# Altium schematic sheet microphone.SchDoc
size A3
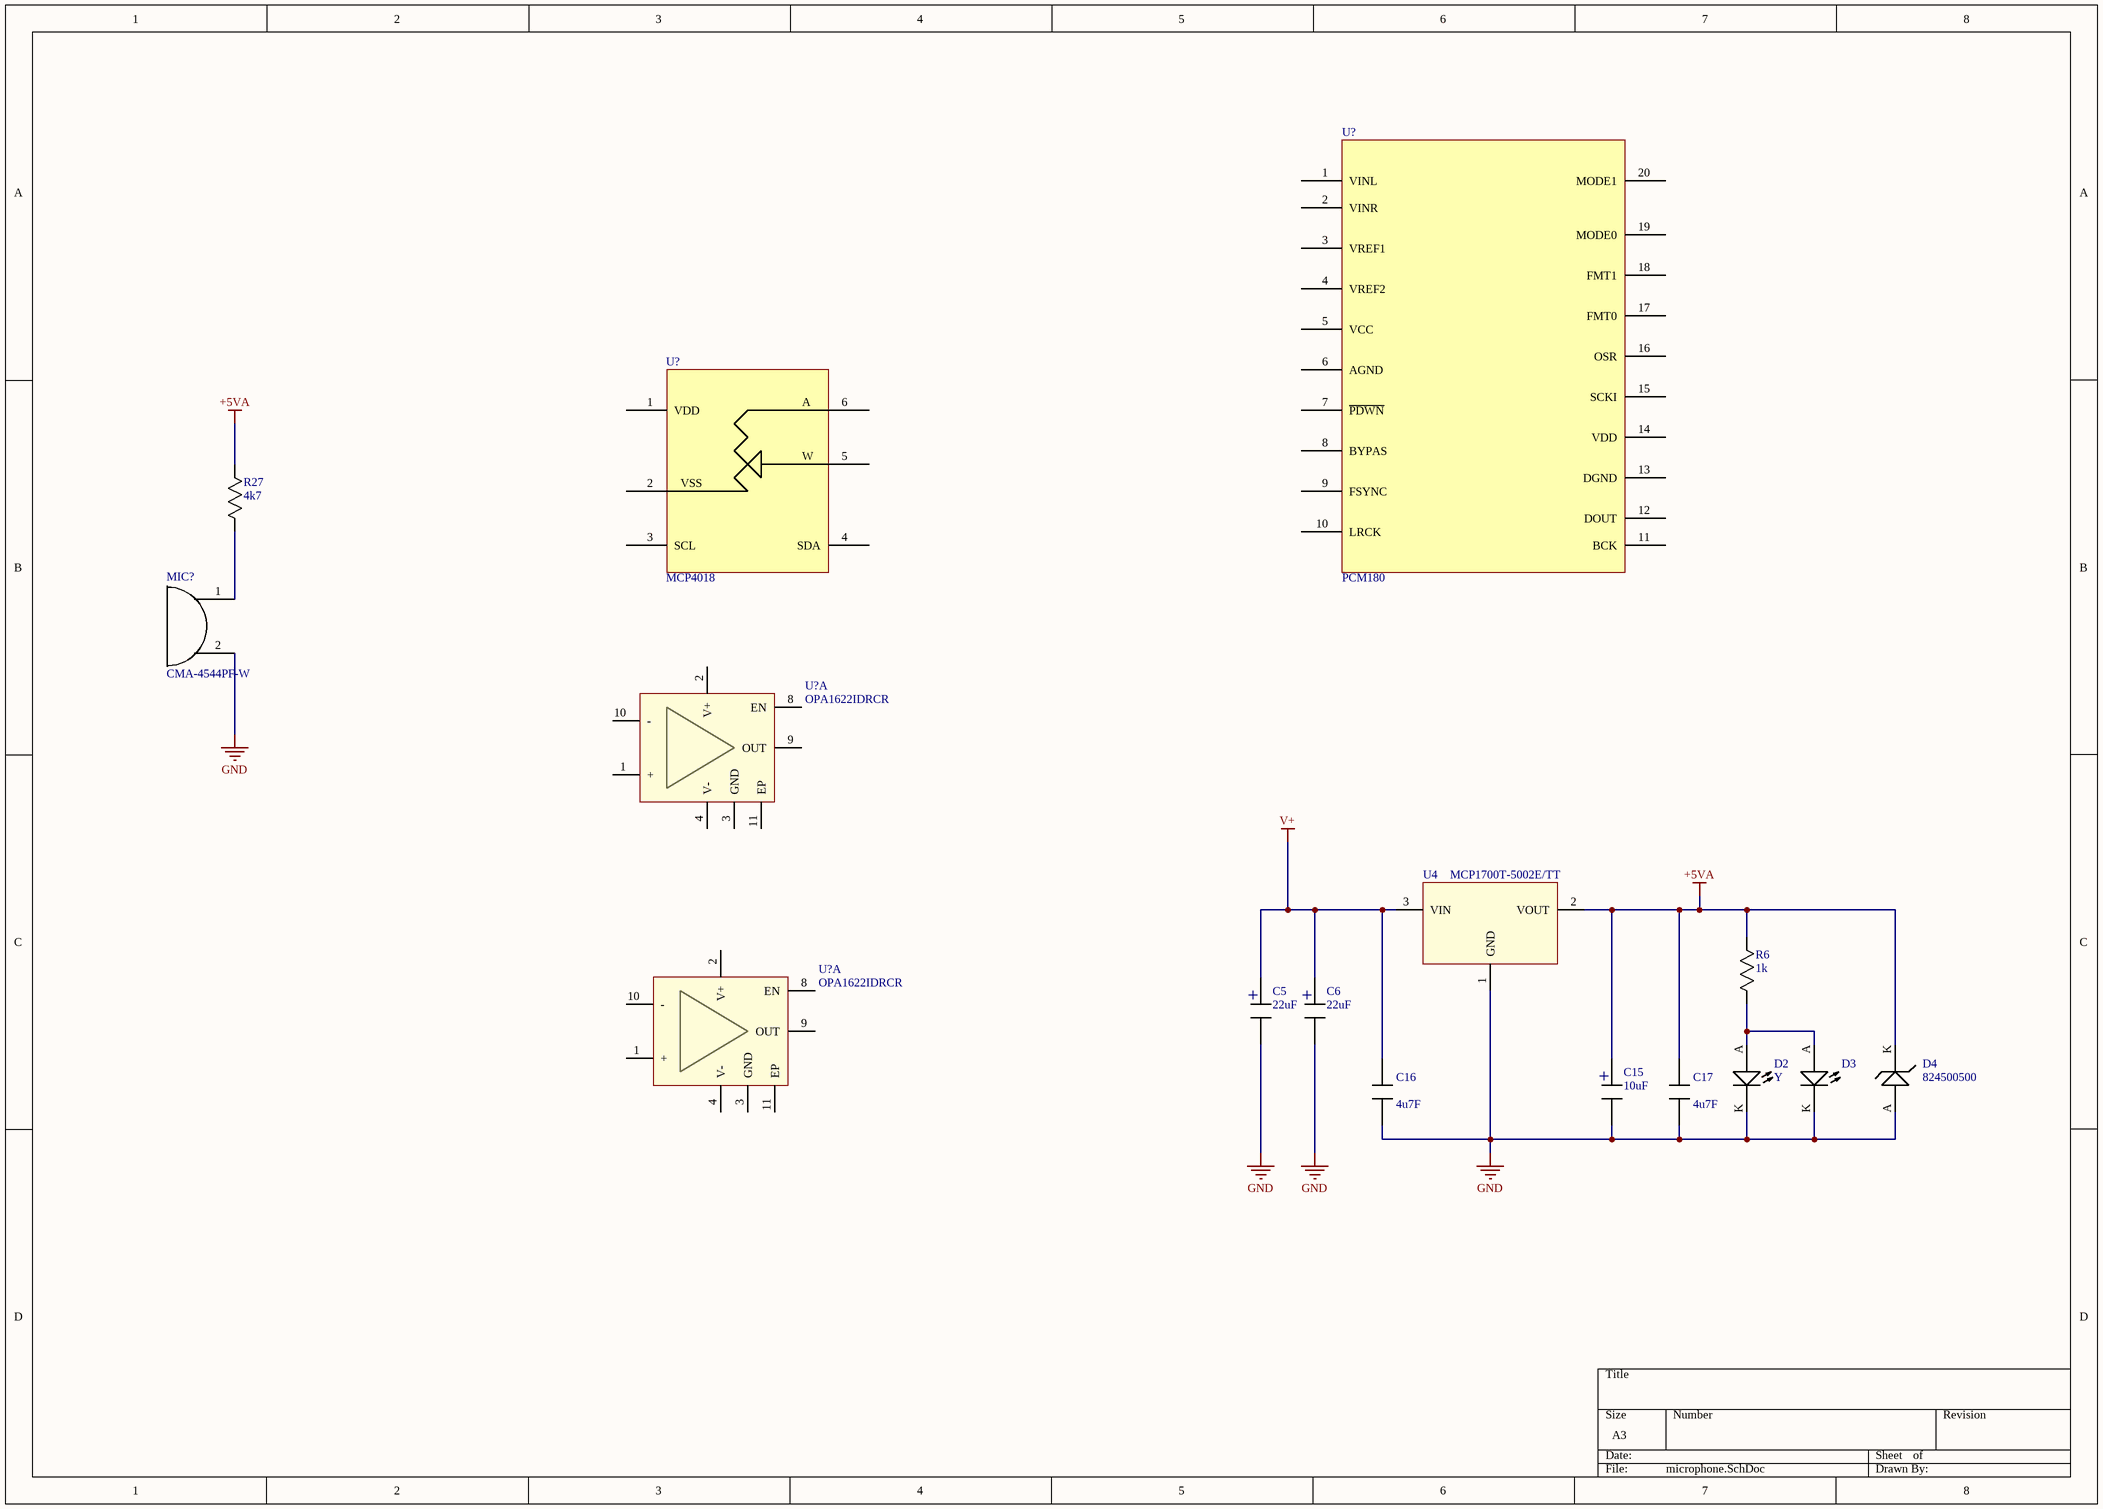
[diagram p0: microphone.SchDoc]

## Parts
(Parts that share a designator on the sheet are numbered #1, #2 ... from top to bottom, then left to right.)
C5  value 22uF  [CAP_RAD_SMD_DIA157]  (hidden comment: Capacitor_Polarized)
C6  value 22uF  [CAP_RAD_SMD_DIA157]  (hidden comment: Capacitor_Polarized)
C15  value 10uF  [CAP_RAD_SMD_DIA157]  (hidden comment: Capacitor_Polarized)
C16  value 4u7F  [0805]  (hidden comment: Capacitor)
C17  value 4u7F  [0603]  (hidden comment: Capacitor)
D2  Type: Y  [0805_LED]  (hidden comment: Diode_LED)
D3  Diode_LED  [0805_LED]  (value not drawn)
D4  Mfg_PN: 824500500  [DIODE_DO-214AC/SMA]  (hidden comment: Diode_zener)
MIC?  CMA-4544PF-W  [MIC]
R6  value 1k  [0603]  (hidden comment: Resistor)
R27  value 4k7  [0603]  (hidden comment: Resistor)
U4  Mfg_PN: MCP1700T-5002E/TT  [SOT23_132]  (hidden comment: MCP1700)
U?#1  PCM180  [20-SSOP]
U?#2  MCP4018  [6-TSSOP]
U?#3  Mfg_PN: OPA1622IDRCR  [10-VFDFN]  (hidden comment: OPA1622)  (part A of 2)
U?#4  Mfg_PN: OPA1622IDRCR  [10-VFDFN]  (hidden comment: OPA1622)  (part A of 2)

## Nets
+5VA: C15.+ C17.1 D4.K R6.2 R27.1 U4.2(VOUT)
GND: C5.- C6.- C15.- C16.2 C17.2 D2.K D3.K D4.A U4.1(GND)
V+: C5.+ C6.+ C16.1 U4.3(VIN)
NetD2_A: D2.A D3.A R6.1

Not connected (* = marked no-connect by the designer): MIC? 1 2; R27 2; U?#1 1(VINL) 2(VINR) 3(VREF1) 4(VREF2) 5(VCC) 6(AGND) 7(~{PDWN}) 8(BYPAS) 9(FSYNC) 10(LRCK) 11(BCK) 12(DOUT) 13(DGND) 14(VDD) 15(SCKI) 16(OSR) 17(FMT0) 18(FMT1) 19(MODE0) 20(MODE1); U?#2 1(VDD) 2(VSS) 3(SCL) 4(SDA) 5(W) 6(A); U?#3 1(+) 2(V+) 3(GND) 4(V-) 8(EN) 9(OUT) 10(-) 11(EP); U?#4 1(+) 2(V+) 3(GND) 4(V-) 8(EN) 9(OUT) 10(-) 11(EP)

## Library data of the parts
C5 = Capacitor_Polarized: Capacitor; Mfg: Panasonic; Mfg_PN: Part Number EEE-FT1V220AR; HelpURL: *; NI: *; Supplier1: Digikey; Supplier1_PN: PCE5012CT-ND; Tolerance: *; Type: *; Rating: *
C6 = Capacitor_Polarized: Capacitor; Mfg: Panasonic; Mfg_PN: EEE-FT1V220AR; HelpURL: *; NI: *; Supplier1: Digikey; Supplier1_PN: PCE5012CT-ND; Tolerance: *; Type: *; Rating: *
C15 = Capacitor_Polarized: Capacitor; Mfg: Nichicon; Mfg_PN: UWX1C100MCL1GB; HelpURL: *; NI: *; Supplier1: Digikey; Supplier1_PN: 493-2100-1-ND; Tolerance: *; Type: *; Rating: *
C16 C17 = Capacitor: Mfg: Samsung; Mfg_PN: CL21A475KAQNNNG; HelpURL: *; NI: *; Supplier1: Digikey; Supplier1_PN: 1276-6462-1-ND; Tolerance: *; Type: *; Rating: *
D2 = Diode_LED: LED; Mfg: Osram; Mfg_PN: LY R976-PS-36; HelpURL: *; NI: *; Supplier1: Digikey; Supplier1_PN: 475-2560-1-ND; Tolerance: *; Rating: *; Value: *
D3 = Diode_LED: LED; Mfg: Osram; Mfg_PN: LY R976-PS-36; Type: Y; HelpURL: *; Supplier1: Digikey; Supplier1_PN: 475-2560-1-ND; Tolerance: *; Rating: *; Value: *
D4 = Diode_zener: Diode; Mfg: Wurth; HelpURL: *; NI: *; Supplier1: Digikey; Supplier1_PN: 732-9974-1-ND; Tolerance: *; Type: *; Rating: *; Value: *
MIC? = CMA-4544PF-W: Mfg: CUI Inc.; CreatedBy: Emile Laplante; HelpURL: https://www.digikey.ca/product-detail/en/cui-inc/CMA-4544PF-W/102-1721-ND/1869981; Mfg Part Number: CMA-4544PF-W; NI: *; Package: *; Power: *; Supplier: Digi-Key; Supplier Part Numer: 102-1721-ND; Temperature: *; Value: *; VerifiedBy: *; Voltage: *
R6 = Resistor: Mfg: Yageo; Mfg_PN: RC0603JR-071KL; HelpURL: *; NI: *; Supplier1: Digikey; Supplier1_PN: 311-1.0KGRCT-ND; Type: *; Rating: *; Tolerance: *
R27 = Resistor: Mfg: Yageo; Mfg_PN: RC0603JR-074K7L; HelpURL: *; NI: *; Supplier1: Digikey; Supplier1_PN: 311-4.7KGRCT-ND; Type: *; Rating: *; Tolerance: *
U4 = MCP1700: Linear voltage regulator; Mfg: Microchip; HelpURL: http://ww1.microchip.com/downloads/en/DeviceDoc/20001826C.pdf; NI: *; Supplier1: Digikey; Supplier1_PN: MCP1700T5002ETTCT-ND; Type: *
U?#1 = PCM180: Mfg Part Number: PCM1802DBR; Mfg: Texas Instruments; CreatedBy: Emile Laplante; HelpURL: https://www.digikey.ca/product-detail/en/texas-instruments/PCM1802DBR/296-26304-1-ND/2254955; NI: *; Power: *; Supplier: digikey; Supplier Part Numer: 296-26304-1-ND; Temperature: *; Value: *; VerifiedBy: *; Voltage: *
U?#2 = MCP4018: Mfg Part Number: MCP4018T-503E/LT; Mfg: Microchip Technology; CreatedBy: Emile Laplante; HelpURL: https://www.digikey.ca/product-detail/en/microchip-technology/MCP4018T-503E-LT/MCP4018T-503E-LTCT-ND/2060154; NI: *; Power: *; Supplier: digikey; Supplier Part Numer: MCP4018T-503E/LTCT-ND; Temperature: *; Value: *; VerifiedBy: *; Voltage: *
U?#3 U?#4 = OPA1622: Dual amplifier (headphone driver); Mfg: Texas Instruments; HelpURL: *; NI: *; Rating: *; Supplier1: Digikey; Supplier1_PN: 296-45038-1-ND; Tolerance: *; Value: *